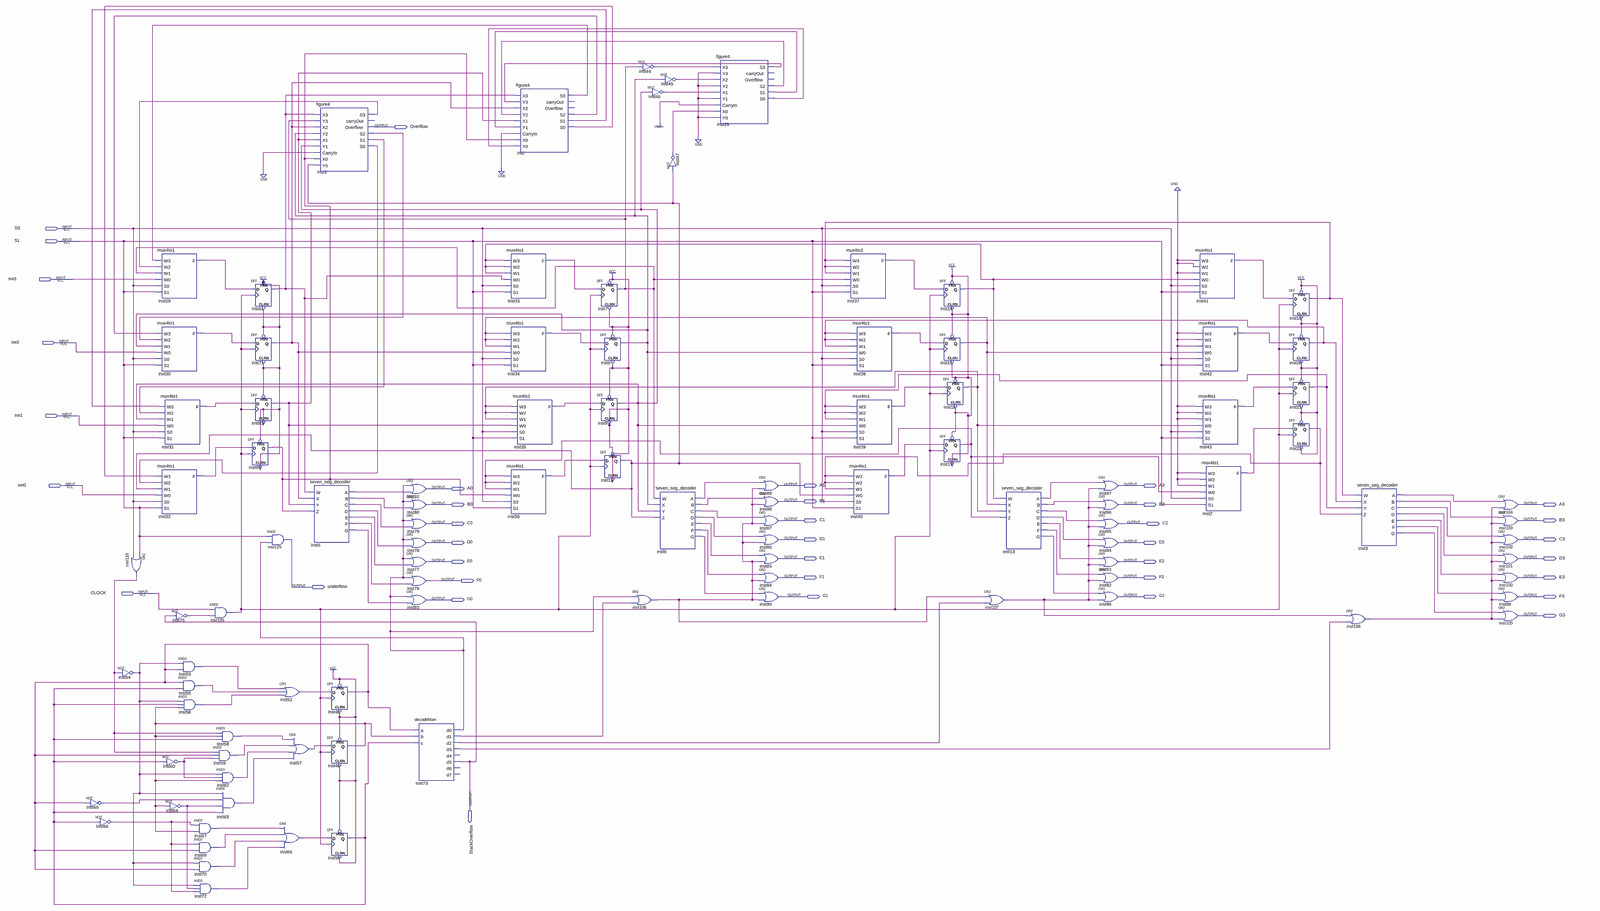
[diagram p0: schematic sheet, whole]
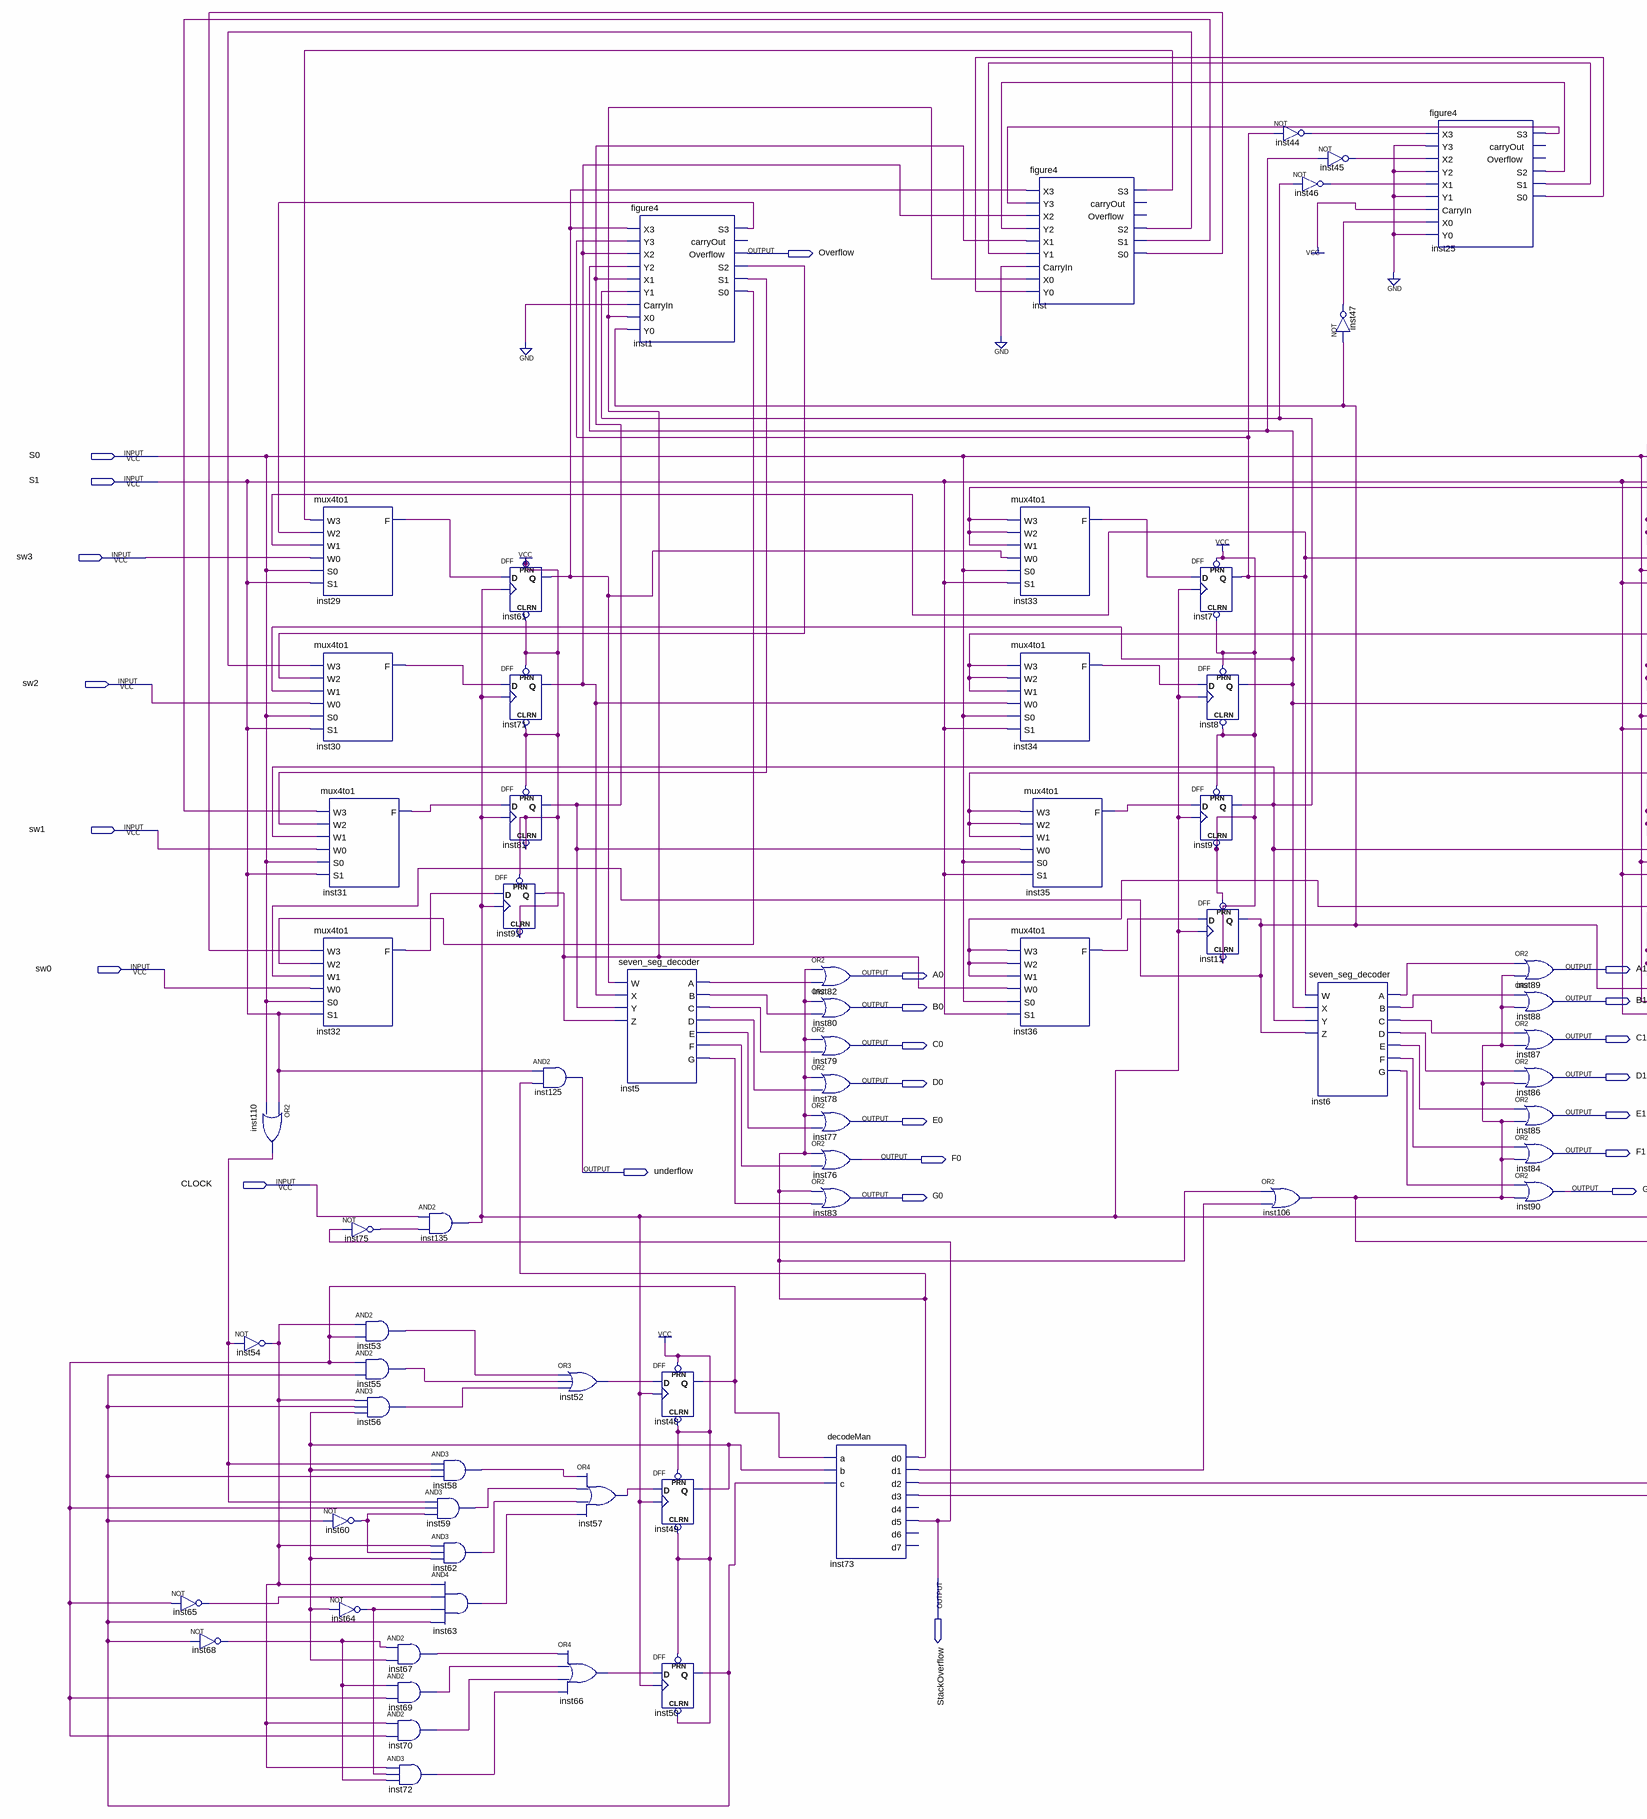
[diagram p1: schematic sheet, left part]
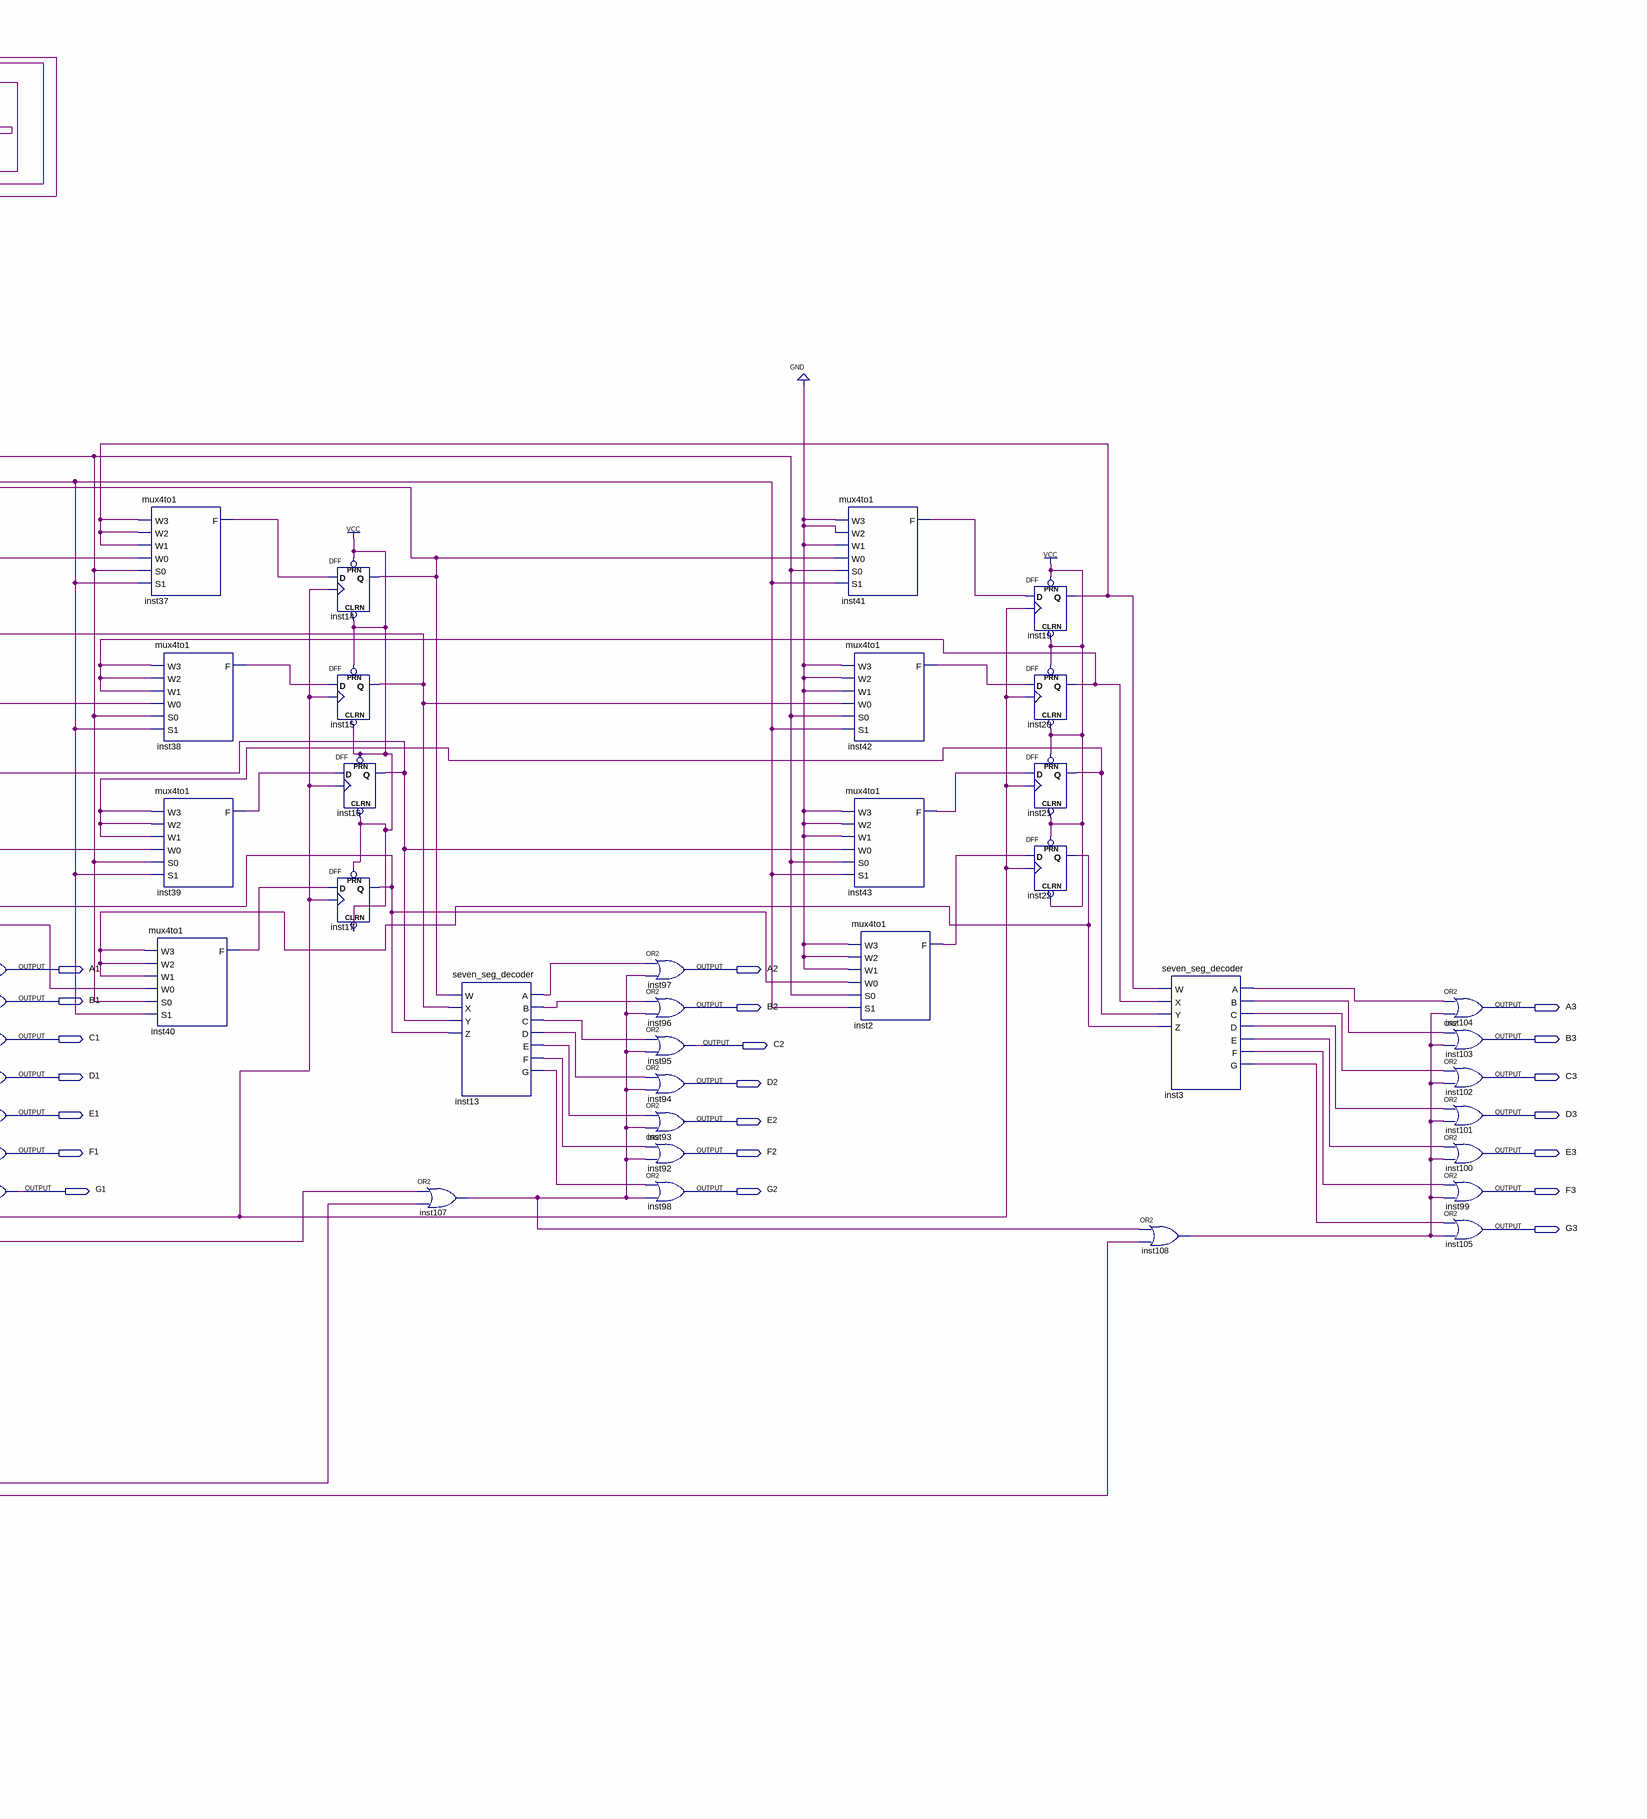
[diagram p2: schematic sheet, right part]
// Quartus schematic StackProject.bdf as structural Verilog: 101 symbols, 38 pins
module StackProject (
  input  S0,
  input  S1,
  input  sw3,
  input  sw2,
  input  sw1,
  input  sw0,
  input  CLOCK,
  output Overflow,
  output A1,
  output A2,
  output A0,
  output B1,
  output B0,
  output B2,
  output A3,
  output C1,
  output B3,
  output C0,
  output C2,
  output D1,
  output C3,
  output D0,
  output D2,
  output E1,
  output D3,
  output E0,
  output E2,
  output F1,
  output F2,
  output E3,
  output F0,
  output underflow,
  output G1,
  output G2,
  output F3,
  output G0,
  output G3,
  output StackOverflow
);

  wire inst1_s0, inst1_s1, inst1_s2, inst1_s3, inst2_f, inst3_a, inst3_b, inst3_c, inst3_d, inst3_e, inst3_f,
       inst3_g, inst5_a, inst5_b, inst5_c, inst5_d, inst5_e, inst5_f, inst5_g, inst6_a, inst6_b, inst6_c,
       inst6_d, inst6_e, inst6_f, inst6_g, inst7_q, inst8_q, inst9_q, inst11_q, inst13_a, inst13_b, inst13_c,
       inst13_d, inst13_e, inst13_f, inst13_g, inst14_q, inst15_q, inst16_q, inst17_q, inst19_q, inst20_q,
       inst21_q, inst22_q, inst25_s0, inst25_s1, inst25_s2, inst25_s3, inst29_f, inst30_f, inst31_f,
       inst32_f, inst33_f, inst34_f, inst35_f, inst36_f, inst37_f, inst38_f, inst39_f, inst40_f, inst41_f,
       inst42_f, inst43_f, inst44_out, inst45_out, inst46_out, inst47_out, inst48_q, inst49_q, inst50_q,
       inst52_out, inst53_out, inst54_out, inst55_out, inst56_out, inst57_out, inst58_out, inst59_out,
       inst60_out, inst61_q, inst62_out, inst63_out, inst64_out, inst65_out, inst66_out, inst67_out,
       inst68_out, inst69_out, inst70_out, inst71_q, inst72_out, inst73_d0, inst73_d1, inst73_d2, inst73_d3,
       inst75_out, inst81_q, inst91_q, inst106_out, inst107_out, inst108_out, inst110_out, inst135_out,
       inst_s0, inst_s1, inst_s2, inst_s3;

  not inst65 (inst65_out, inst48_q);
  not inst68 (inst68_out, inst50_q);
  or inst110 (inst110_out, S1, S0);
  not inst54 (inst54_out, inst110_out);
  mux4to1 inst29 (.W3(inst_s3), .W2(inst1_s3), .W1(inst7_q), .W0(sw3), .S0(S0), .S1(S1), .F(inst29_f));
  mux4to1 inst30 (.W3(inst_s2), .W2(inst1_s2), .W1(inst8_q), .W0(sw2), .S0(S0), .S1(S1), .F(inst30_f));
  mux4to1 inst31 (.W3(inst_s1), .W2(inst1_s1), .W1(inst9_q), .W0(sw1), .S0(S0), .S1(S1), .F(inst31_f));
  mux4to1 inst32 (.W3(inst_s0), .W2(inst1_s0), .W1(inst11_q), .W0(sw0), .S0(S0), .S1(S1), .F(inst32_f));
  not inst75 (inst75_out, StackOverflow);
  and inst53 (inst53_out, inst54_out, inst48_q);
  and inst55 (inst55_out, inst48_q, inst50_q);
  and inst56 (inst56_out, inst54_out, inst50_q, inst49_q);
  not inst60 (inst60_out, inst50_q);
  not inst64 (inst64_out, inst49_q);
  and inst135 (inst135_out, CLOCK, inst75_out);
  and inst67 (inst67_out, inst68_out, inst49_q);
  and inst69 (inst69_out, inst68_out, inst48_q);
  and inst70 (inst70_out, inst54_out, inst48_q);
  and inst72 (inst72_out, inst54_out, inst64_out, inst68_out);
  and inst58 (inst58_out, inst110_out, inst49_q, inst50_q);
  and inst59 (inst59_out, inst110_out, inst48_q, inst60_out);
  and inst62 (inst62_out, inst54_out, inst60_out, inst49_q);
  and inst63 (inst63_out, inst54_out, inst65_out, inst64_out, inst50_q);
  DFF inst61 (.CLRN(1'b1), .CLK(inst135_out), .D(inst29_f), .PRN(1'b1), .Q(inst61_q));
  DFF inst71 (.CLRN(1'b1), .CLK(inst135_out), .D(inst30_f), .PRN(1'b1), .Q(inst71_q));
  DFF inst81 (.CLRN(1'b1), .CLK(inst135_out), .D(inst31_f), .PRN(1'b1), .Q(inst81_q));
  DFF inst91 (.CLRN(1'b1), .CLK(inst135_out), .D(inst32_f), .PRN(1'b1), .Q(inst91_q));
  and inst125 (underflow, S1, inst73_d0);
  or inst52 (inst52_out, inst53_out, inst55_out, inst56_out);
  or inst66 (inst66_out, inst67_out, inst69_out, inst70_out, inst72_out);
  seven_seg_decoder inst5 (
    .W(inst61_q), .X(inst71_q), .Y(inst81_q), .Z(inst91_q), .A(inst5_a), .B(inst5_b), .C(inst5_c),
    .D(inst5_d), .E(inst5_e), .F(inst5_f), .G(inst5_g));
  or inst57 (inst57_out, inst58_out, inst59_out, inst62_out, inst63_out);
  figure4 inst1 (
    .X3(inst61_q), .Y3(inst7_q), .X2(inst71_q), .Y2(inst8_q), .X1(inst81_q), .Y1(inst9_q), .CarryIn(1'b0),
    .X0(inst91_q), .Y0(inst11_q), .S3(inst1_s3), .Overflow(Overflow), .S2(inst1_s2), .S1(inst1_s1),
    .S0(inst1_s0));  // open: carryOut
  DFF inst48 (.CLRN(1'b1), .CLK(inst135_out), .D(inst52_out), .PRN(1'b1), .Q(inst48_q));
  DFF inst49 (.CLRN(1'b1), .CLK(inst135_out), .D(inst57_out), .PRN(1'b1), .Q(inst49_q));
  DFF inst50 (.CLRN(1'b1), .CLK(inst135_out), .D(inst66_out), .PRN(1'b1), .Q(inst50_q));
  or inst82 (A0, inst73_d0, inst5_a);
  or inst80 (B0, inst73_d0, inst5_b);
  or inst79 (C0, inst73_d0, inst5_c);
  or inst78 (D0, inst73_d0, inst5_d);
  or inst77 (E0, inst73_d0, inst5_e);
  or inst76 (F0, inst73_d0, inst5_f);
  or inst83 (G0, inst73_d0, inst5_g);
  decodeMan inst73 (
    .a(inst48_q), .b(inst49_q), .c(inst50_q), .d0(inst73_d0), .d1(inst73_d1), .d2(inst73_d2), .d3(inst73_d3),
    .d5(StackOverflow));  // open: d4, d6, d7
  figure4 inst (
    .X3(inst61_q), .Y3(inst25_s3), .X2(inst71_q), .Y2(inst25_s2), .X1(inst81_q), .Y1(inst25_s1),
    .CarryIn(1'b0), .X0(inst91_q), .Y0(inst25_s0), .S3(inst_s3), .S2(inst_s2), .S1(inst_s1), .S0(inst_s0));  // open: carryOut, Overflow
  mux4to1 inst33 (.W3(inst14_q), .W2(inst14_q), .W1(inst14_q), .W0(inst61_q), .S0(S0), .S1(S1), .F(inst33_f));
  mux4to1 inst34 (.W3(inst15_q), .W2(inst15_q), .W1(inst15_q), .W0(inst71_q), .S0(S0), .S1(S1), .F(inst34_f));
  mux4to1 inst35 (.W3(inst16_q), .W2(inst16_q), .W1(inst16_q), .W0(inst81_q), .S0(S0), .S1(S1), .F(inst35_f));
  mux4to1 inst36 (.W3(inst17_q), .W2(inst17_q), .W1(inst17_q), .W0(inst91_q), .S0(S0), .S1(S1), .F(inst36_f));
  DFF inst7 (.CLRN(1'b1), .CLK(inst135_out), .D(inst33_f), .PRN(1'b1), .Q(inst7_q));
  DFF inst8 (.CLRN(1'b1), .CLK(inst135_out), .D(inst34_f), .PRN(1'b1), .Q(inst8_q));
  DFF inst9 (.CLRN(1'b1), .CLK(inst135_out), .D(inst35_f), .PRN(1'b1), .Q(inst9_q));
  DFF inst11 (.CLRN(1'b1), .CLK(inst135_out), .D(inst36_f), .PRN(1'b1), .Q(inst11_q));
  not inst44 (inst44_out, inst7_q);
  or inst106 (inst106_out, inst73_d0, inst73_d1);
  not inst45 (inst45_out, inst8_q);
  not inst46 (inst46_out, inst9_q);
  not inst47 (inst47_out, inst11_q);
  seven_seg_decoder inst6 (
    .W(inst7_q), .X(inst8_q), .Y(inst9_q), .Z(inst11_q), .A(inst6_a), .B(inst6_b), .C(inst6_c), .D(inst6_d),
    .E(inst6_e), .F(inst6_f), .G(inst6_g));
  figure4 inst25 (
    .X3(inst44_out), .Y3(1'b0), .X2(inst45_out), .Y2(1'b0), .X1(inst46_out), .Y1(1'b0), .CarryIn(1'b1),
    .X0(inst47_out), .Y0(1'b0), .S3(inst25_s3), .S2(inst25_s2), .S1(inst25_s1), .S0(inst25_s0));  // open: carryOut, Overflow
  or inst89 (A1, inst6_a, inst106_out);
  or inst88 (B1, inst6_b, inst106_out);
  or inst87 (C1, inst6_c, inst106_out);
  or inst86 (D1, inst6_d, inst106_out);
  or inst85 (E1, inst6_e, inst106_out);
  or inst84 (F1, inst6_f, inst106_out);
  or inst90 (G1, inst6_g, inst106_out);
  mux4to1 inst37 (.W3(inst19_q), .W2(inst19_q), .W1(inst19_q), .W0(inst7_q), .S0(S0), .S1(S1), .F(inst37_f));
  mux4to1 inst38 (.W3(inst20_q), .W2(inst20_q), .W1(inst20_q), .W0(inst8_q), .S0(S0), .S1(S1), .F(inst38_f));
  mux4to1 inst39 (.W3(inst21_q), .W2(inst21_q), .W1(inst21_q), .W0(inst9_q), .S0(S0), .S1(S1), .F(inst39_f));
  mux4to1 inst40 (.W3(inst22_q), .W2(inst22_q), .W1(inst22_q), .W0(inst11_q), .S0(S0), .S1(S1), .F(inst40_f));
  DFF inst14 (.CLRN(1'b1), .CLK(inst135_out), .D(inst37_f), .PRN(1'b1), .Q(inst14_q));
  DFF inst15 (.CLRN(1'b1), .CLK(inst135_out), .D(inst38_f), .PRN(1'b1), .Q(inst15_q));
  DFF inst16 (.CLRN(1'b1), .CLK(inst135_out), .D(inst39_f), .PRN(1'b1), .Q(inst16_q));
  DFF inst17 (.CLRN(1'b1), .CLK(inst135_out), .D(inst40_f), .PRN(1'b1), .Q(inst17_q));
  or inst107 (inst107_out, inst106_out, inst73_d2);
  seven_seg_decoder inst13 (
    .W(inst14_q), .X(inst15_q), .Y(inst16_q), .Z(inst17_q), .A(inst13_a), .B(inst13_b), .C(inst13_c),
    .D(inst13_d), .E(inst13_e), .F(inst13_f), .G(inst13_g));
  or inst97 (A2, inst13_a, inst107_out);
  or inst96 (B2, inst13_b, inst107_out);
  or inst95 (C2, inst13_c, inst107_out);
  or inst94 (D2, inst13_d, inst107_out);
  or inst93 (E2, inst13_e, inst107_out);
  or inst92 (F2, inst13_f, inst107_out);
  or inst98 (G2, inst13_g, inst107_out);
  mux4to1 inst41 (.W3(1'b0), .W2(1'b0), .W1(1'b0), .W0(inst14_q), .S0(S0), .S1(S1), .F(inst41_f));
  mux4to1 inst42 (.W3(1'b0), .W2(1'b0), .W1(1'b0), .W0(inst15_q), .S0(S0), .S1(S1), .F(inst42_f));
  mux4to1 inst43 (.W3(1'b0), .W2(1'b0), .W1(1'b0), .W0(inst16_q), .S0(S0), .S1(S1), .F(inst43_f));
  mux4to1 inst2 (.W3(1'b0), .W2(1'b0), .W1(1'b0), .W0(inst17_q), .S0(S0), .S1(S1), .F(inst2_f));
  DFF inst19 (.CLRN(1'b1), .CLK(inst135_out), .D(inst41_f), .PRN(1'b1), .Q(inst19_q));
  DFF inst20 (.CLRN(1'b1), .CLK(inst135_out), .D(inst42_f), .PRN(1'b1), .Q(inst20_q));
  DFF inst21 (.CLRN(1'b1), .CLK(inst135_out), .D(inst43_f), .PRN(1'b1), .Q(inst21_q));
  DFF inst22 (.CLRN(1'b1), .CLK(inst135_out), .D(inst2_f), .PRN(1'b1), .Q(inst22_q));
  or inst108 (inst108_out, inst107_out, inst73_d3);
  seven_seg_decoder inst3 (
    .W(inst19_q), .X(inst20_q), .Y(inst21_q), .Z(inst22_q), .A(inst3_a), .B(inst3_b), .C(inst3_c),
    .D(inst3_d), .E(inst3_e), .F(inst3_f), .G(inst3_g));
  or inst104 (A3, inst3_a, inst108_out);
  or inst103 (B3, inst3_b, inst108_out);
  or inst102 (C3, inst3_c, inst108_out);
  or inst101 (D3, inst3_d, inst108_out);
  or inst100 (E3, inst3_e, inst108_out);
  or inst99 (F3, inst3_f, inst108_out);
  or inst105 (G3, inst3_g, inst108_out);
endmodule
